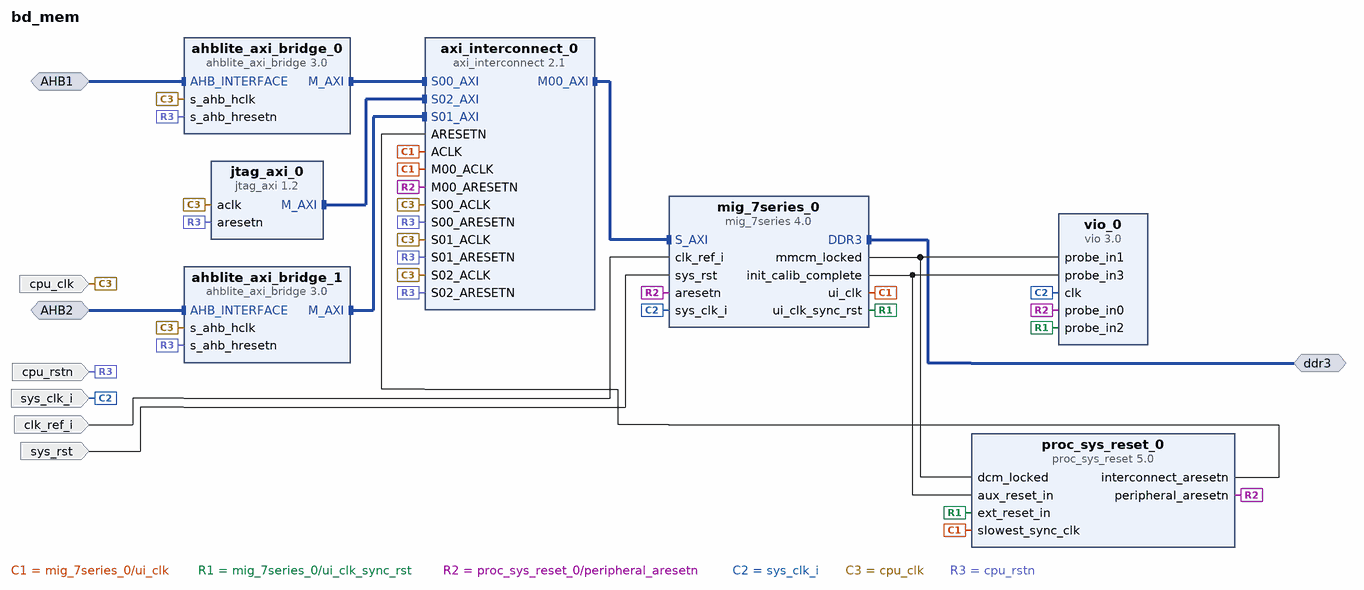
[diagram p0: block diagram of the top level]
# Vivado block design bd_mem, xc7a200tfbg676-2, Vivado 2017.1
create_bd_design bd_mem

create_bd_intf_port -mode Master -vlnv xilinx.com:interface:ddrx_rtl:1.0 ddr3
create_bd_intf_port -mode Slave -vlnv xilinx.com:interface:ahblite_rtl:2.0 AHB1
create_bd_intf_port -mode Slave -vlnv xilinx.com:interface:ahblite_rtl:2.0 AHB2
create_bd_port -dir I -type clk clk_ref_i
set_property -dict {CONFIG.FREQ_HZ 200000000} [get_bd_ports clk_ref_i]
create_bd_port -dir I -type clk sys_clk_i
create_bd_port -dir I -type rst sys_rst
set_property -dict {CONFIG.POLARITY ACTIVE_HIGH} [get_bd_ports sys_rst]
create_bd_port -dir I -type clk cpu_clk
create_bd_port -dir I -type rst cpu_rstn

create_bd_cell -type ip -vlnv xilinx.com:ip:ahblite_axi_bridge:3.0 ahblite_axi_bridge_0
set_property -dict {CONFIG.C_M_AXI_THREAD_ID_WIDTH 4 CONFIG.C_M_AXI_SUPPORTS_NARROW_BURST 1} [get_bd_cells ahblite_axi_bridge_0]
create_bd_cell -type ip -vlnv xilinx.com:ip:ahblite_axi_bridge:3.0 ahblite_axi_bridge_1
set_property -dict {CONFIG.C_M_AXI_SUPPORTS_NARROW_BURST 1} [get_bd_cells ahblite_axi_bridge_1]
create_bd_cell -type ip -vlnv xilinx.com:ip:axi_interconnect:2.1 axi_interconnect_0
set_property -dict {CONFIG.NUM_SI 3 CONFIG.NUM_MI 1} [get_bd_cells axi_interconnect_0]
create_bd_cell -type ip -vlnv xilinx.com:ip:jtag_axi:1.2 jtag_axi_0
create_bd_cell -type ip -vlnv xilinx.com:ip:mig_7series:4.0 mig_7series_0
set_property -dict [list \
  CONFIG.XML_INPUT_FILE mig_a.prj \
  CONFIG.RESET_BOARD_INTERFACE Custom \
  CONFIG.BOARD_MIG_PARAM Custom \
] [get_bd_cells mig_7series_0]
create_bd_cell -type ip -vlnv xilinx.com:ip:proc_sys_reset:5.0 proc_sys_reset_0
set_property -dict {CONFIG.C_AUX_RESET_HIGH 0} [get_bd_cells proc_sys_reset_0]
create_bd_cell -type ip -vlnv xilinx.com:ip:vio:3.0 vio_0
set_property -dict {CONFIG.C_NUM_PROBE_OUT 0 CONFIG.C_NUM_PROBE_IN 4} [get_bd_cells vio_0]

# ---- connections ----

connect_bd_intf_net [get_bd_intf_pins axi_interconnect_0/M00_AXI] [get_bd_intf_pins mig_7series_0/S_AXI]
connect_bd_intf_net [get_bd_intf_pins ahblite_axi_bridge_0/M_AXI] [get_bd_intf_pins axi_interconnect_0/S00_AXI]
connect_bd_intf_net [get_bd_intf_pins ahblite_axi_bridge_1/M_AXI] [get_bd_intf_pins axi_interconnect_0/S01_AXI]
connect_bd_intf_net [get_bd_intf_pins jtag_axi_0/M_AXI] [get_bd_intf_pins axi_interconnect_0/S02_AXI]
connect_bd_intf_net [get_bd_intf_ports ddr3] [get_bd_intf_pins mig_7series_0/DDR3]
connect_bd_intf_net [get_bd_intf_ports AHB1] [get_bd_intf_pins ahblite_axi_bridge_0/AHB_INTERFACE]
connect_bd_intf_net -intf_net AHB_INTERFACE_1_1 [get_bd_intf_ports AHB2] [get_bd_intf_pins ahblite_axi_bridge_1/AHB_INTERFACE]
connect_bd_net [get_bd_pins mig_7series_0/mmcm_locked] [get_bd_pins proc_sys_reset_0/dcm_locked] [get_bd_pins vio_0/probe_in1]
connect_bd_net [get_bd_pins mig_7series_0/ui_clk] \
  [get_bd_pins proc_sys_reset_0/slowest_sync_clk] [get_bd_pins axi_interconnect_0/ACLK] \
  [get_bd_pins axi_interconnect_0/M00_ACLK]
connect_bd_net [get_bd_pins mig_7series_0/ui_clk_sync_rst] [get_bd_pins proc_sys_reset_0/ext_reset_in] [get_bd_pins vio_0/probe_in2]
connect_bd_net -net ARESETN_1 [get_bd_pins proc_sys_reset_0/interconnect_aresetn] [get_bd_pins axi_interconnect_0/ARESETN]
connect_bd_net [get_bd_pins proc_sys_reset_0/peripheral_aresetn] \
  [get_bd_pins mig_7series_0/aresetn] [get_bd_pins vio_0/probe_in0] [get_bd_pins axi_interconnect_0/M00_ARESETN]
connect_bd_net [get_bd_ports clk_ref_i] [get_bd_pins mig_7series_0/clk_ref_i]
connect_bd_net [get_bd_ports sys_clk_i] [get_bd_pins mig_7series_0/sys_clk_i] [get_bd_pins vio_0/clk]
connect_bd_net [get_bd_ports sys_rst] [get_bd_pins mig_7series_0/sys_rst]
connect_bd_net -net S00_ACLK_1 [get_bd_ports cpu_clk] \
  [get_bd_pins ahblite_axi_bridge_0/s_ahb_hclk] [get_bd_pins ahblite_axi_bridge_1/s_ahb_hclk] [get_bd_pins jtag_axi_0/aclk] \
  [get_bd_pins axi_interconnect_0/S00_ACLK] [get_bd_pins axi_interconnect_0/S01_ACLK] \
  [get_bd_pins axi_interconnect_0/S02_ACLK]
connect_bd_net -net S00_ARESETN_1 [get_bd_ports cpu_rstn] \
  [get_bd_pins ahblite_axi_bridge_0/s_ahb_hresetn] [get_bd_pins ahblite_axi_bridge_1/s_ahb_hresetn] \
  [get_bd_pins jtag_axi_0/aresetn] [get_bd_pins axi_interconnect_0/S00_ARESETN] [get_bd_pins axi_interconnect_0/S01_ARESETN] \
  [get_bd_pins axi_interconnect_0/S02_ARESETN]
connect_bd_net [get_bd_pins mig_7series_0/init_calib_complete] [get_bd_pins proc_sys_reset_0/aux_reset_in] [get_bd_pins vio_0/probe_in3]

# ---- address map ----
assign_bd_address -offset 0x00000000 -range 128M -target_address_space [get_bd_addr_spaces AHB1] [get_bd_addr_segs mig_7series_0/memmap/memaddr]
assign_bd_address -offset 0x00000000 -range 128M -target_address_space [get_bd_addr_spaces AHB2] [get_bd_addr_segs mig_7series_0/memmap/memaddr]
assign_bd_address -offset 0x00000000 -range 128M -target_address_space [get_bd_addr_spaces jtag_axi_0/Data] [get_bd_addr_segs mig_7series_0/memmap/memaddr]

validate_bd_design
save_bd_design
